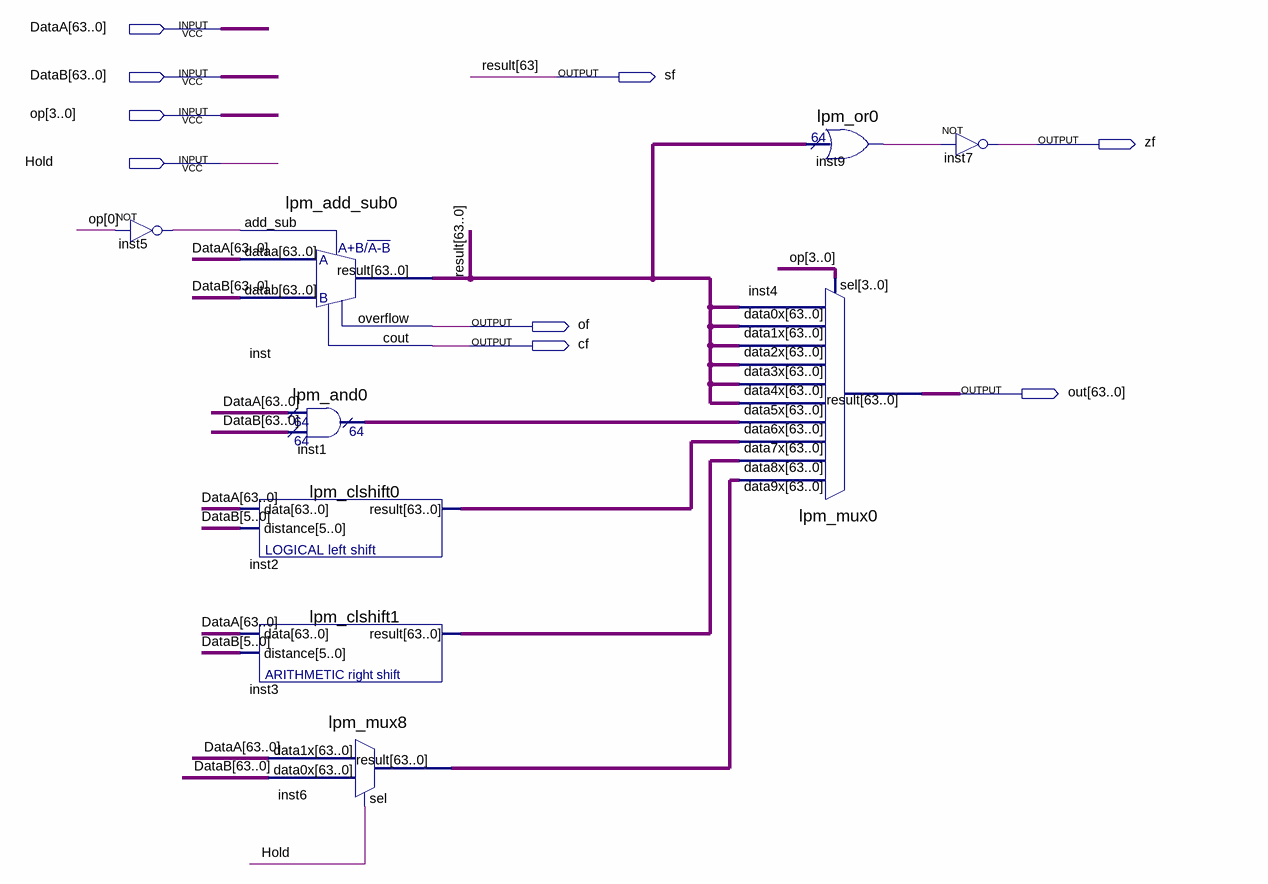
[diagram p0: schematic sheet]
// Quartus schematic ALU.bdf as structural Verilog: 9 symbols, 9 pins
module ALU (
  input  [63:0] DataA,
  input  [63:0] DataB,
  input  [3:0] op,
  input  Hold,
  output sf,
  output zf,
  output of,
  output cf,
  output [63:0] out
);

  wire inst5_out, inst9_result;
  wire [62:0] result;
  wire [63:0] inst1_result, inst2_result, inst3_result, inst6_result;

  not inst5 (inst5_out, op[0]);
  lpm_add_sub0 inst (
    .dataa(DataA), .datab(DataB), .add_sub(inst5_out), .result({sf, result}), .overflow(of), .cout(cf));
  lpm_clshift0 inst2 (.data(DataA), .distance(DataB[5:0]), .result(inst2_result));
  lpm_clshift1 inst3 (.data(DataA), .distance(DataB[5:0]), .result(inst3_result));
  lpm_and0 inst1 (.data0x(DataA), .data1x(DataB), .result(inst1_result));
  lpm_mux8 inst6 (.data1x(DataA), .data0x(DataB), .sel(Hold), .result(inst6_result));
  lpm_mux0 inst4 (
    .data9x(inst6_result), .data8x(inst3_result), .data7x(inst2_result), .data6x(inst1_result),
    .data5x({sf, result}), .data4x({sf, result}), .data3x({sf, result}), .data2x({sf, result}),
    .data1x({sf, result}), .data0x({sf, result}), .sel(op), .result(out));
  lpm_or0 inst9 (.data({sf, result}), .result(inst9_result));
  not inst7 (zf, inst9_result);

  // Other names for the same wires on the sheet: result[63] = sf
endmodule
